# Altium schematic sheet SCHEMATIC.schdoc
size 383 x 159 mm
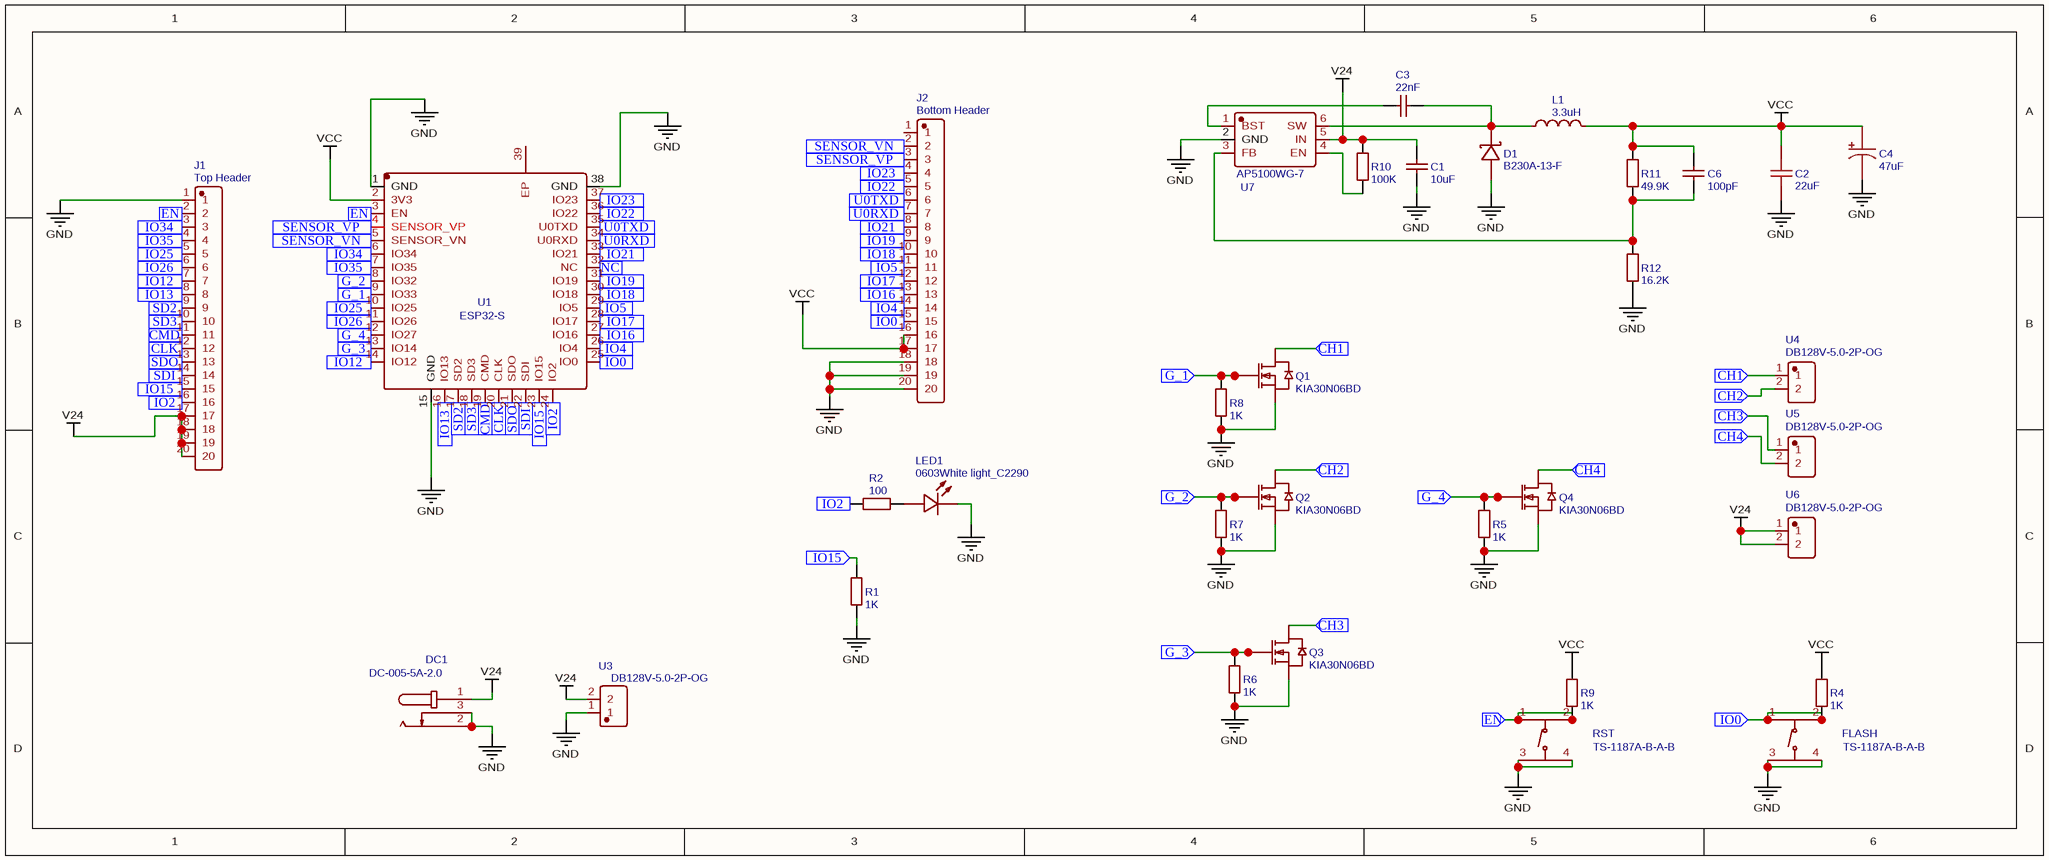
[diagram p0: SCHEMATIC.schdoc]

## Parts
C1  10uF  [C0805]
C2  22uF  [C0603]
C3  22nF  [C0603]
C4  47uF  [CAP-SMD_BD5.0-L5.3-W5.3-RD]
C6  100pF  [C0603]
D1  B230A-13-F  [SMA_L4.4-W2.6-LS5.0-RD]
DC1  DC-005-5A-2.0  [DC-IN-TH_DC-005-5A-2.0]
FLASH  TS-1187A-B-A-B  [SW-SMD_4P-L5.1-W5.1-P3.70-LS6.4]
J1  Top Header  [HDR-TH_20P-P2.54-V]
J2  Bottom Header  [HDR-TH_20P-P2.54-V]
L1  3.3uH  [IND-SMD_L4.2-W4.4_MWSA0402S-XX]
LED1  0603White light_C2290  [LED0603-R-RD]
Q1  KIA30N06BD  [TO-252-2_L6.6-W6.1-P4.57-LS9.9-TL-CW]
Q2  KIA30N06BD  [TO-252-2_L6.6-W6.1-P4.57-LS9.9-TL-CW]
Q3  KIA30N06BD  [TO-252-2_L6.6-W6.1-P4.57-LS9.9-TL-CW]
Q4  KIA30N06BD  [TO-252-2_L6.6-W6.1-P4.57-LS9.9-TL-CW]
R1  1K  [R0603]
R2  100  [R0603]
R4  1K  [R0603]
R5  1K  [R0603]
R6  1K  [R0603]
R7  1K  [R0603]
R8  1K  [R0603]
R9  1K  [R0603]
R10  100K  [R0603]
R11  49.9K  [R0603]
R12  16.2K  [R0603]
RST  TS-1187A-B-A-B  [SW-SMD_4P-L5.1-W5.1-P3.70-LS6.4]
U1  ESP32-S  [WIRELM-SMD_ESP32-S]
U3  DB128V-5.0-2P-OG  [CONN-TH_DB128V-5.0-2P-XX]
U4  DB128V-5.0-2P-OG  [CONN-TH_DB128V-5.0-2P-XX]
U5  DB128V-5.0-2P-OG  [CONN-TH_DB128V-5.0-2P-XX]
U6  DB128V-5.0-2P-OG  [CONN-TH_DB128V-5.0-2P-XX]
U7  AP5100WG-7  [SOT-23-6_L2.9-W1.6-P0.95-LS2.8-BR]

## Ports
CH1 (in), CH2 (in), CH3 (in), CH4 (in), CLK (in), CMD (in), EN (in), G_1 (in), G_2 (in), G_3 (in), G_4 (in), IO0 (in), IO2 (in), IO4 (in), IO5 (in), IO12 (in), IO13 (in), IO15 (in), IO16 (in), IO17 (in), IO18 (in), IO19 (in), IO21 (in), IO22 (in), IO23 (in), IO25 (in), IO26 (in), IO34 (in), IO35 (in), NC (in), SD2 (in), SD3 (in), SDI (in), SDO (in), SENSOR_VN (in), SENSOR_VP (in), U0RXD (in), U0TXD (in)

## Nets
GND: C1.2 C2.2 C4.2 D1.2(A) DC1.2 DC1.3 FLASH.3(C) FLASH.4(D) J1.1 J2.18 J2.19 J2.20 LED1.2(K) Q1.3(S) Q2.3(S) Q3.3(S) Q4.3(S) R1.2 R5.2 R6.2 R7.2 R8.2 R12.2 RST.3(C) RST.4(D) U1.1(GND) U1.15(GND) U1.38(GND) U3.1 U7.2(GND)
V24: C1.1 DC1.1 J1.17 J1.18 J1.19 J1.20 R10.1 U3.2 U6.1 U6.2 U7.5(IN)
VCC: C2.1 C4.1 C6.1 J2.16 J2.17 L1.2 R4.1 R9.1 R11.1 U1.2(3V3)
CH1: Q1.2(D) U4.1 ; port CH1
CH2: Q2.2(D) U4.2 ; port CH2
CH3: Q3.2(D) U5.1 ; port CH3
CH4: Q4.2(D) U5.2 ; port CH4
CLK: J1.12 U1.20(CLK) ; port CLK
CMD: J1.11 U1.19(CMD) ; port CMD
EN: J1.2 R9.2 RST.1(A) RST.2(B) U1.3(EN) ; port EN
G_1: Q1.1(G) R8.1 U1.9(IO33) ; port G_1
G_2: Q2.1(G) R7.1 U1.8(IO32) ; port G_2
G_3: Q3.1(G) R6.1 U1.13(IO14) ; port G_3
G_4: Q4.1(G) R5.1 U1.12(IO27) ; port G_4
IO0: FLASH.1(A) FLASH.2(B) J2.15 R4.2 U1.25(IO0) ; port IO0
IO2: J1.16 R2.1 U1.24(IO2) ; port IO2
IO4: J2.14 U1.26(IO4) ; port IO4
IO5: J2.11 U1.29(IO5) ; port IO5
IO12: J1.7 U1.14(IO12) ; port IO12
IO13: J1.8 U1.16(IO13) ; port IO13
IO15: J1.15 R1.1 U1.23(IO15) ; port IO15
IO16: J2.13 U1.27(IO16) ; port IO16
IO17: J2.12 U1.28(IO17) ; port IO17
IO18: J2.10 U1.30(IO18) ; port IO18
IO19: J2.9 U1.31(IO19) ; port IO19
IO21: J2.8 U1.33(IO21) ; port IO21
IO22: J2.5 U1.36(IO22) ; port IO22
IO23: J2.4 U1.37(IO23) ; port IO23
IO25: J1.5 U1.10(IO25) ; port IO25
IO26: J1.6 U1.11(IO26) ; port IO26
IO34: J1.3 U1.6(IO34) ; port IO34
IO35: J1.4 U1.7(IO35) ; port IO35
NC: U1.32(NC) ; port NC
SD2: J1.9 U1.17(SD2) ; port SD2
SD3: J1.10 U1.18(SD3) ; port SD3
SDI: J1.14 U1.22(SDI) ; port SDI
SDO: J1.13 U1.21(SDO) ; port SDO
SENSOR_VN: J2.2 U1.5(SENSOR_VN) ; port SENSOR_VN
SENSOR_VP: J2.3 U1.4(SENSOR_VP) ; port SENSOR_VP
U0RXD: J2.7 U1.34(U0RXD) ; port U0RXD
U0TXD: J2.6 U1.35(U0TXD) ; port U0TXD
NetC3_1: C3.1 U7.1(BST)
NetC3_2: C3.2 D1.1(K) L1.1 U7.6(SW)
NetC6_2: C6.2 R11.2 R12.1 U7.3(FB)
NetLED1_1: LED1.1(A) R2.2
NetR10_2: R10.2 U7.4(EN)

Not connected (* = marked no-connect by the designer): J2 1; U1 39(EP)

## Library data of the parts
C1 = 10uF: BOM_Manufacturer Part: CL21A106KAYNNNE; BOM_Manufacturer: SAMSUNG; nameAlias: Capacitance; SMT Type: Basic; BOM_Supplier: LCSC; BOM_Supplier Part: C15850; BOM_JLCPCB SMD: Yes; spicePre: C; spiceSymbolName: CL21A106KAYNNNE
C2 = 22uF: BOM_Manufacturer: SAMSUNG; BOM_Manufacturer Part: CL10A226MQ8NRNC; nameAlias: Capacitance; SMT Type: Basic; BOM_Supplier: LCSC; BOM_Supplier Part: C59461; BOM_JLCPCB SMD: Yes; spicePre: C; spiceSymbolName: CL10A226MQ8NRNC
C3 = 22nF: BOM_Manufacturer Part: CL10B223KB8NNNC; BOM_Manufacturer: SAMSUNG; nameAlias: Capacitance; SMT Type: Basic; BOM_Supplier: LCSC; BOM_Supplier Part: C21122; BOM_JLCPCB SMD: Yes; spicePre: C; spiceSymbolName: CL10B223KB8NNNC
C4 = 47uF: BOM_Manufacturer: Lelon; BOM_Manufacturer Part: VES470M1CTR-0505; nameAlias: Capacitance; Contributor: LCSC; SMT Type: Extend; BOM_Supplier: LCSC; BOM_Supplier Part: C134798; BOM_JLCPCB SMD: Yes; spicePre: C; spiceSymbolName: VES470M1CTR-0505
C6 = 100pF: BOM_Manufacturer Part: CL10C101JB8NNNC; BOM_Manufacturer: SAMSUNG; nameAlias: Capacitance; SMT Type: Basic; BOM_Supplier: LCSC; BOM_Supplier Part: C14858; BOM_JLCPCB SMD: Yes; spicePre: C; spiceSymbolName: CL10C101JB8NNNC
D1 = B230A-13-F: BOM_Manufacturer: DIODES; SMT Type: Extend; BOM_Supplier: LCSC; BOM_Manufacturer Part: B230A-13-F; BOM_Supplier Part: C12889; BOM_JLCPCB SMD: Yes; spicePre: D; spiceSymbolName: B230A-13-F
DC1 = DC-005-5A-2.0: BOM_Manufacturer: XKB Enterprise; Contributor: LCSC; BOM_Supplier: LCSC; BOM_Supplier Part: C381116; BOM_Manufacturer Part: DC-005-5A-2.0; spicePre: D; spiceSymbolName: DC-005-5A-2.0
FLASH RST = TS-1187A-B-A-B: BOM_Manufacturer: XKB Enterprise; Contributor: LCSC; SMT Type: Extend; BOM_Supplier: LCSC; BOM_Supplier Part: C318884; BOM_Manufacturer Part: TS-1187A-B-A-B; BOM_JLCPCB SMD: Yes; spicePre: S; spiceSymbolName: TS-1187A-B-A-B
J1 = Top Header: BOM_Manufacturer: BOOMELE; BOM_Manufacturer Part: 2.54mm 1*20PHeader; SMT Type: Extend; BOM_Supplier: LCSC; image: //image.lceda.cn/szlcsc/C50981.jpg; BOM_Supplier Part: C50981; BOM_LCSC Assembly: Yes; spicePre: J; spiceSymbolName: Header-Male-2.54_1x20
J2 = Bottom Header: BOM_Manufacturer: BOOMELE; BOM_Manufacturer Part: 2.54mm 1*20PHeader; SMT Type: Extend; BOM_Supplier: LCSC; image: //image.lceda.cn/szlcsc/C50981.jpg; BOM_Supplier Part: C50981; BOM_LCSC Assembly: Yes; spicePre: J; spiceSymbolName: Header-Male-2.54_1x20
L1 = 3.3uH: BOM_Manufacturer: Sunlord; BOM_Manufacturer Part: MWSA0402S-3R3MT; nameAlias: Inductance; Contributor: LCSC; SMT Type: Extend; BOM_Supplier: LCSC; BOM_Supplier Part: C408336; BOM_JLCPCB SMD: Yes; spicePre: L; spiceSymbolName: MWSA0402S-3R3MT
LED1 = 0603White light_C2290: BOM_Manufacturer: KENTO; SMT Type: Basic; BOM_Supplier: LCSC; BOM_Manufacturer Part: 0603White light; image: //image.lceda.cn/szlcsc/C2290.jpg; BOM_Supplier Part: C2290; BOM_JLCPCB SMD: Yes; spicePre: L; spiceSymbolName: 0603White light_C2290
Q1-Q4 = KIA30N06BD: BOM_Manufacturer: KIA; SMT Type: Extend; BOM_Supplier: LCSC; BOM_Manufacturer Part: KIA30N06BD; BOM_Supplier Part: C134931; BOM_JLCPCB SMD: Yes; spicePre: Q; spiceSymbolName: KIA30N06BD
R1 R4-R9 = 1K: BOM_Manufacturer: UniOhm; BOM_Manufacturer Part: 0603WAF1001T5E; nameAlias: Resistance (Ohms); SMT Type: Basic; BOM_Supplier: LCSC; BOM_Supplier Part: C21190; BOM_JLCPCB SMD: Yes; spicePre: R; spiceSymbolName: 0603WAF1001T5E
R2 = 100: BOM_Manufacturer: UniOhm; BOM_Manufacturer Part: 0603WAF1000T5E; nameAlias: Resistance (Ohms); SMT Type: Basic; BOM_Supplier: LCSC; BOM_Supplier Part: C22775; BOM_JLCPCB SMD: Yes; spicePre: R; spiceSymbolName: 0603WAF1000T5E
R10 = 100K: BOM_Manufacturer: UniOhm; BOM_Manufacturer Part: 0603WAF1003T5E; nameAlias: Resistance (Ohms); SMT Type: Basic; BOM_Supplier: LCSC; BOM_Supplier Part: C25803; BOM_JLCPCB SMD: Yes; spicePre: R; spiceSymbolName: 0603WAF1003T5E
R11 = 49.9K: BOM_Manufacturer: UniOhm; BOM_Manufacturer Part: 0603WAF4992T5E; nameAlias: Resistance (Ohms); SMT Type: Basic; BOM_Supplier: LCSC; BOM_Supplier Part: C23184; BOM_JLCPCB SMD: Yes; spicePre: R; spiceSymbolName: 0603WAF4992T5E
R12 = 16.2K: BOM_Manufacturer: UniOhm; BOM_Manufacturer Part: 0603WAF1622T5E; nameAlias: Resistance (Ohms); SMT Type: Extend; BOM_Supplier: LCSC; BOM_Supplier Part: C22885; BOM_JLCPCB SMD: Yes; spicePre: R; spiceSymbolName: 0603WAF1622T5E
U1 = ESP32-S: BOM_Manufacturer: Ai-Thinker; Contributor: LCSC; BOM_Supplier: LCSC; BOM_Supplier Part: C277944; BOM_Manufacturer Part: ESP32-S; spicePre: U; spiceSymbolName: ESP32-S
U3-U6 = DB128V-5.0-2P-OG: BOM_Manufacturer: DIBO; Contributor: LCSC; BOM_Supplier: LCSC; BOM_Supplier Part: C424694; BOM_Manufacturer Part: DB128V-5.0-2P-OG; spicePre: U; spiceSymbolName: DB128V-5.0-2P-OG
U7 = AP5100WG-7: BOM_Manufacturer: DIODES; Contributor: LCSC; SMT Type: Extend; BOM_Supplier: LCSC; BOM_Manufacturer Part: AP5100WG-7; BOM_Supplier Part: C114647; BOM_JLCPCB SMD: Yes; spicePre: U; spiceSymbolName: AP5100WG-7